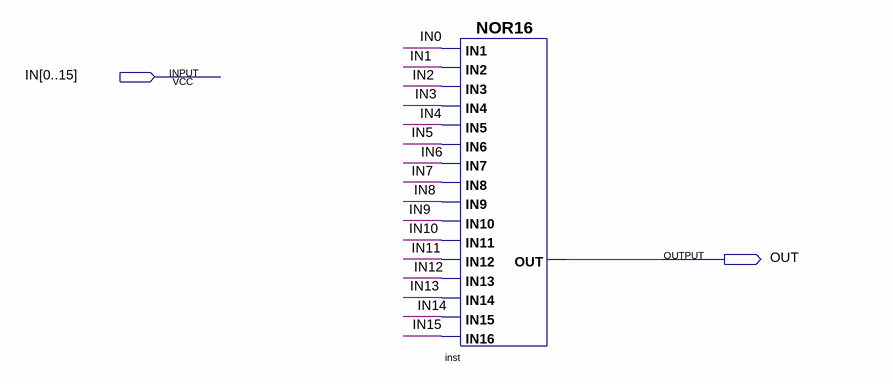
[diagram p0: schematic sheet]
// Quartus schematic NOR16BUS.bdf as structural Verilog: 1 symbols, 2 pins
module NOR16BUS (
  input  [0:15] IN,
  output OUT
);

  nor inst (OUT, IN[0], IN[1], IN[2], IN[3], IN[4], IN[5], IN[6], IN[7], IN[8], IN[9], IN[10], IN[11], IN[12], IN[13], IN[14], IN[15]);
endmodule
